# EAGLE schematic BG96 Arduino Uno Shield (EAGLE 9.5.2)
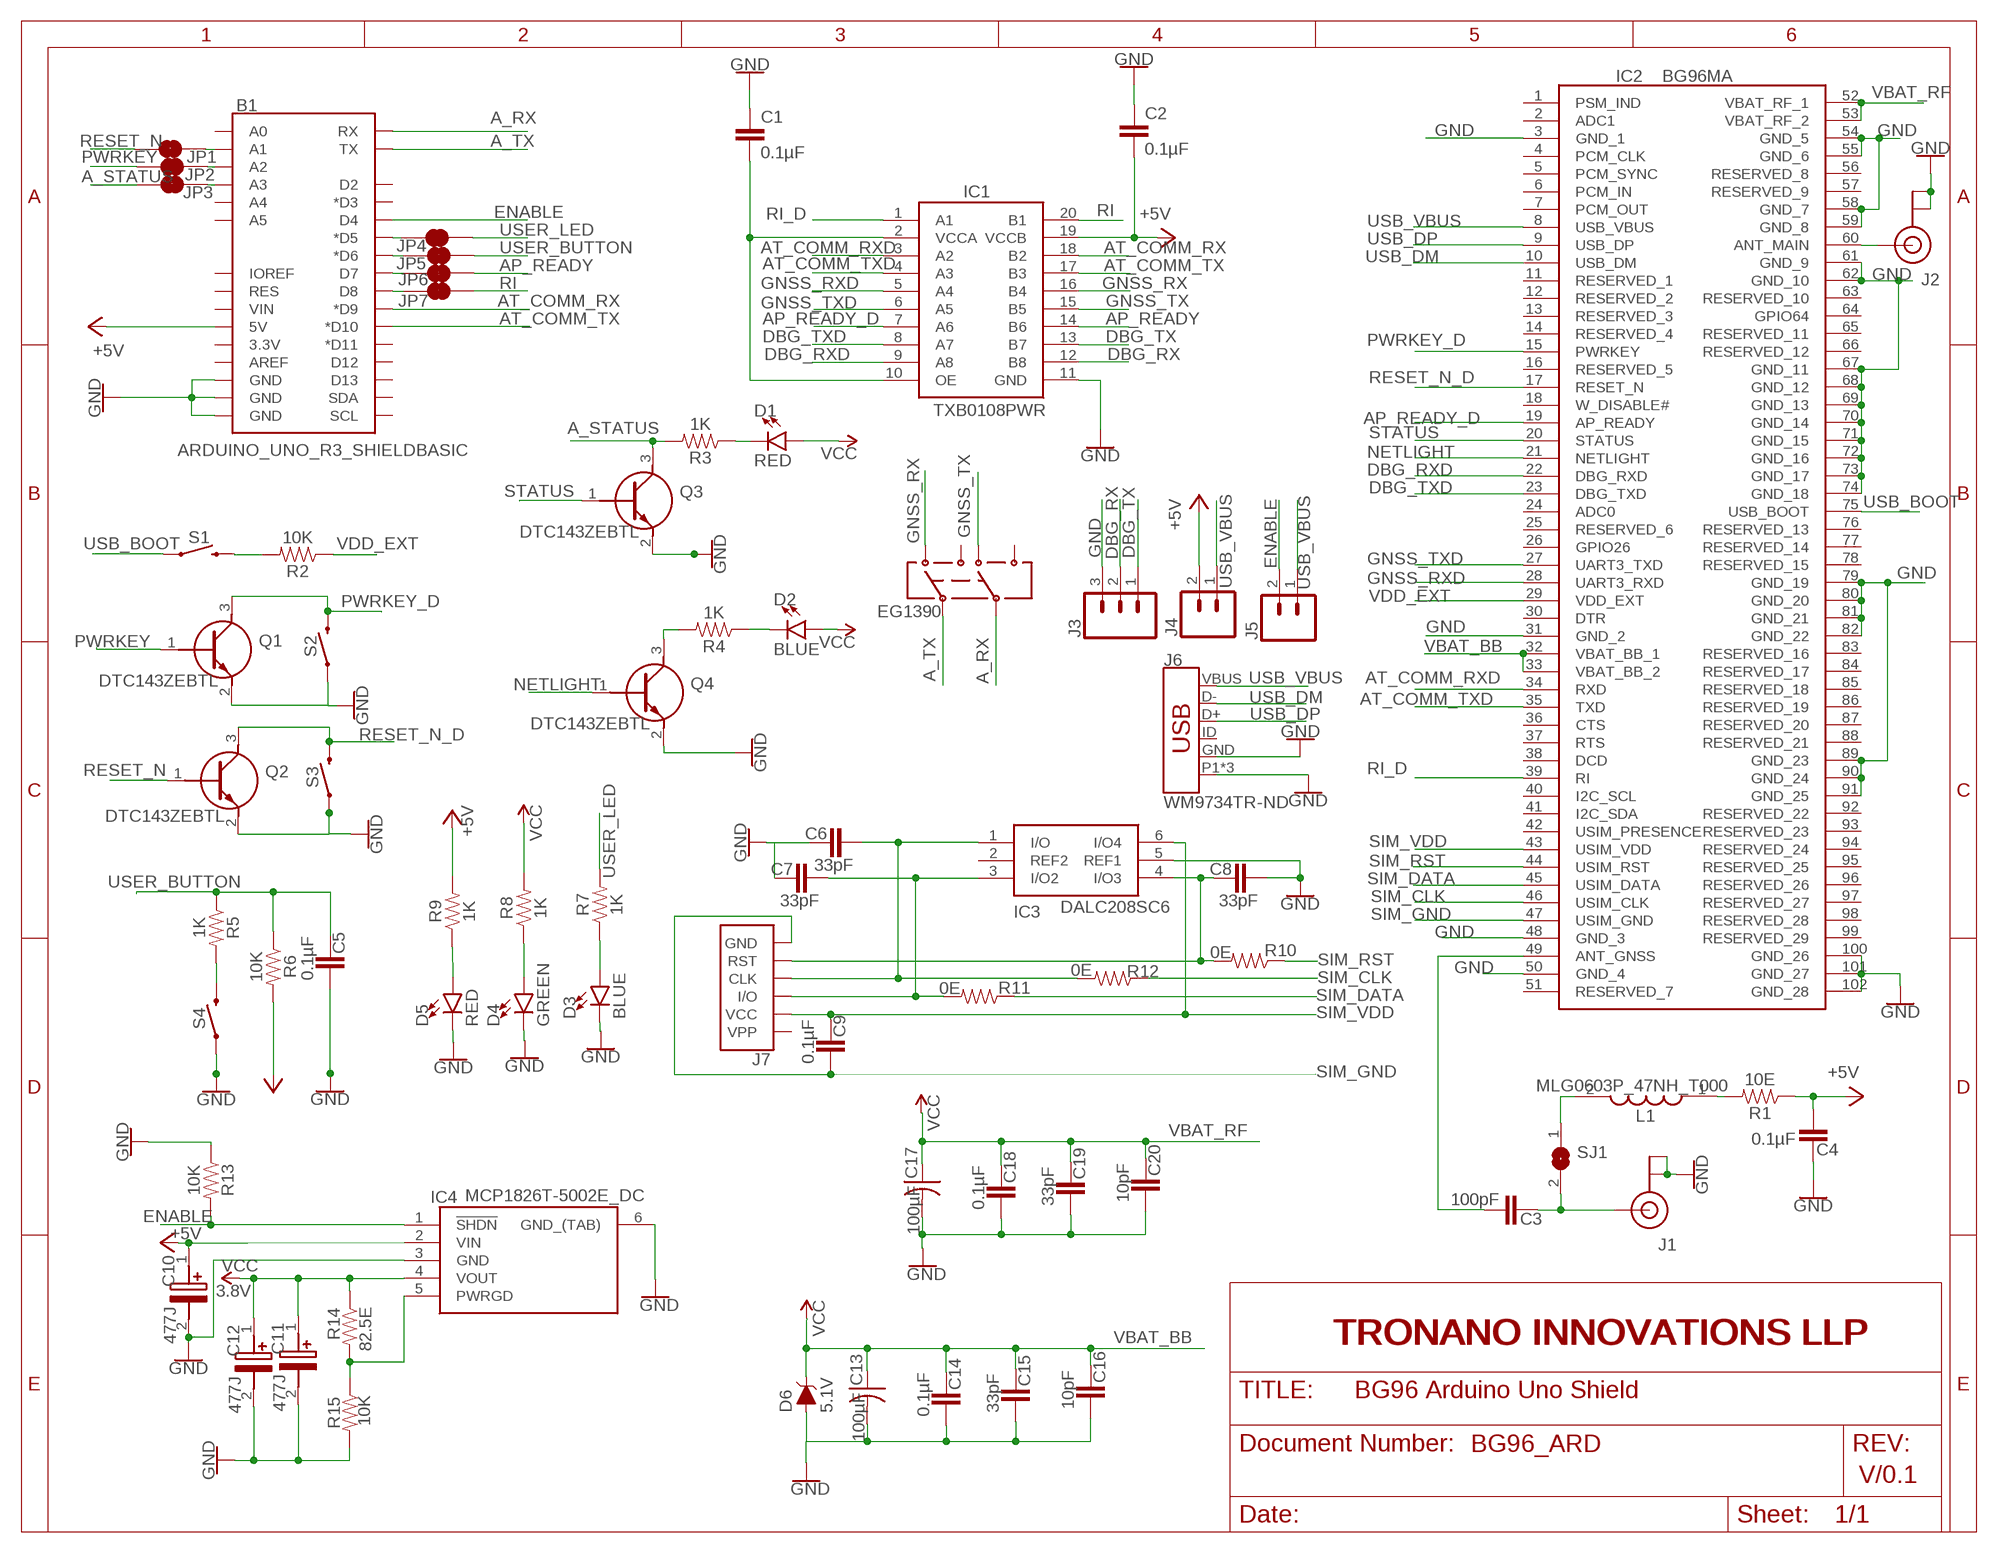
[diagram p0: schematic, sheet 1]

## Parts
B1  ARDUINO_UNO_R3_SHIELDBASIC  [UNO_R3_SHIELD]
C1  0.1µF  0.33UF/330NF-0805-50V-10%  [0805]
C2  0.1µF  0.33UF/330NF-0805-50V-10%  [0805]
C3  100pF  0.33UF/330NF-0805-50V-10%  [0805]
C4  0.1µF  0.33UF/330NF-0805-50V-10%  [0805]
C5  0.1µF  0.33UF/330NF-0805-50V-10%  [0805]
C6  33pF  0.33UF/330NF-0805-50V-10%  [0805]
C7  33pF  0.33UF/330NF-0805-50V-10%  [0805]
C8  33pF  0.33UF/330NF-0805-50V-10%  [0805]
C9  0.1µF  0.33UF/330NF-0805-50V-10%  [0805]
C10  477J  T495D477M006ATE0457280  [CAPPM7343X310N]
C11  477J  T495D477M006ATE0457280  [CAPPM7343X310N]
C12  477J  T495D477M006ATE0457280  [CAPPM7343X310N]
C13  100µF  C-USC0805K  [C0805K]
C14  0.1µF  0.33UF/330NF-0805-50V-10%  [0805]
C15  33pF  0.33UF/330NF-0805-50V-10%  [0805]
C16  10pF  0.33UF/330NF-0805-50V-10%  [0805]
C17  100µF  C-USC0805K  [C0805K]
C18  0.1µF  0.33UF/330NF-0805-50V-10%  [0805]
C19  33pF  0.33UF/330NF-0805-50V-10%  [0805]
C20  10pF  0.33UF/330NF-0805-50V-10%  [0805]
D1  RED  LED-BLUE1206  [LED-1206]
D2  BLUE  LED-BLUE1206  [LED-1206]
D3  BLUE  LED-BLUE1206  [LED-1206]
D4  GREEN  LED-BLUE1206  [LED-1206]
D5  RED  LED-BLUE1206  [LED-1206]
D6  5.1V  DIODE-ZENER-MMSZ5232BS  [SOD-323]
EG1390  SWITCH-DPDT-SMD-AYZ0202  [SWITCH_DPDT_SMD_AYZ0202]
IC1  TXB0108PWR  [SOP65P640X120-20N]
IC2  BG96MA  [BG96MA]
IC3  DALC208SC6  [SOT95P280X145-6N]
IC4  MCP1826T-5002E_DC  [SOT127P706X180-6N]
J1  U.FL  [U.FL]
J2  U.FL  [U.FL]
J3  CONN_03LOCK  [1X03_LOCK]
J4  CONN_02  [1X02]
J5  CONN_02  [1X02]
J6  WM9734TR-ND  USB_MICRO-B_FEMALE-SMT-VERT  [USB-B-MICRO-SMD_VERT]
J7  SIMHOLDERSIM  [SIMHOLDER]
JP1  JUMPER-SMT_2_NC_TRACE_NO-SILK  [SMT-JUMPER_2_NC_TRACE_NO-SILK]
JP2  JUMPER-SMT_2_NC_TRACE_NO-SILK  [SMT-JUMPER_2_NC_TRACE_NO-SILK]
JP3  JUMPER-SMT_2_NC_TRACE_NO-SILK  [SMT-JUMPER_2_NC_TRACE_NO-SILK]
JP4  JUMPER-SMT_2_NC_TRACE_NO-SILK  [SMT-JUMPER_2_NC_TRACE_NO-SILK]
JP5  JUMPER-SMT_2_NC_TRACE_NO-SILK  [SMT-JUMPER_2_NC_TRACE_NO-SILK]
JP6  JUMPER-SMT_2_NC_TRACE_NO-SILK  [SMT-JUMPER_2_NC_TRACE_NO-SILK]
JP7  JUMPER-SMT_2_NC_TRACE_NO-SILK  [SMT-JUMPER_2_NC_TRACE_NO-SILK]
L1  MLG0603P_47NH_T000  MLG0603P47NHT000  [INDC0603X33N]
Q1  DTC143ZEBTL  [SOTFL50P160X85-3N]
Q2  DTC143ZEBTL  [SOTFL50P160X85-3N]
Q3  DTC143ZEBTL  [SOTFL50P160X85-3N]
Q4  DTC143ZEBTL  [SOTFL50P160X85-3N]
R1  10E  0.3OHM-0805-1/8W-1%  [0805]
R2  10K  0.3OHM-0805-1/8W-1%  [0805]
R3  1K  0.3OHM-0805-1/8W-1%  [0805]
R4  1K  0.3OHM-0805-1/8W-1%  [0805]
R5  1K  0.3OHM-0805-1/8W-1%  [0805]
R6  10K  0.3OHM-0805-1/8W-1%  [0805]
R7  1K  0.3OHM-0805-1/8W-1%  [0805]
R8  1K  0.3OHM-0805-1/8W-1%  [0805]
R9  1K  0.3OHM-0805-1/8W-1%  [0805]
R10  0E  0.3OHM-0805-1/8W-1%  [0805]
R11  0E  0.3OHM-0805-1/8W-1%  [0805]
R12  0E  0.3OHM-0805-1/8W-1%  [0805]
R13  10K  0.3OHM-0805-1/8W-1%  [0805]
R14  82.5E  0.3OHM-0805-1/8W-1%  [0805]
R15  10K  0.3OHM-0805-1/8W-1%  [0805]
S1  MOMENTARY-SWITCH-SPST-SMD-6.2MM-TALL  [TACTILE_SWITCH_SMD_6.2MM_TALL]
S2  MOMENTARY-SWITCH-SPST-SMD-6.2MM-TALL  [TACTILE_SWITCH_SMD_6.2MM_TALL]
S3  MOMENTARY-SWITCH-SPST-SMD-6.2MM-TALL  [TACTILE_SWITCH_SMD_6.2MM_TALL]
S4  MOMENTARY-SWITCH-SPST-SMD-6.2MM-TALL  [TACTILE_SWITCH_SMD_6.2MM_TALL]
SJ1  SJ  [SJ]

## Nets
3.8V: C11.1(+) C12.1(+) IC4.4(VOUT) R14.1 ; supply symbol labelled VCC
+5V: B1.5V C2.2 C4.1 C10.1(+) IC1.19(VCCB) IC4.2(VIN) J4.2 R1.1 R6.2 R9.2
A_RX: B1.RX EG1390.5
A_STATUS: JP3.1 Q3.3(C) R3.2
A_TX: B1.TX EG1390.2
AP_READY: IC1.14(B6) JP6.2
AP_READY_D: IC1.7(A6) IC2.19(AP_READY)
AT_COMM_RX: B1.D9(*D9) IC1.18(B2)
AT_COMM_RXD: IC1.3(A2) IC2.34(RXD)
AT_COMM_TX: B1.D10(*D10) IC1.17(B3)
AT_COMM_TXD: IC1.4(A3) IC2.35(TXD)
DBG_RX: IC1.12(B8) J3.2
DBG_RXD: IC1.9(A8) IC2.22(DBG_RXD)
DBG_TX: IC1.13(B7) J3.1
DBG_TXD: IC1.8(A7) IC2.23(DBG_TXD)
ENABLE: B1.D4 IC4.1(!SHDN) J5.2 R13.2
GND: B1.GND@0(GND) B1.GND@1(GND) B1.GND@2(GND) C1.1 C2.1 C4.2 C5.2 C6.1 C7.1 C8.2 C10.2(-) C11.2(-) C12.2(-) C13.2 C14.2 C15.2 C16.2 C17.2 C18.2 C19.2 C20.2 D3.C D4.C D5.C D6.A IC1.11(GND) IC2.3(GND_1) IC2.31(GND_2) IC2.48(GND_3) IC2.50(GND_4) IC2.54(GND_5) IC2.55(GND_6) IC2.58(GND_7) IC2.59(GND_8) IC2.61(GND_9) IC2.62(GND_10) IC2.67(GND_11) IC2.68(GND_12) IC2.69(GND_13) IC2.70(GND_14) IC2.71(GND_15) IC2.72(GND_16) IC2.73(GND_17) IC2.74(GND_18) IC2.79(GND_19) IC2.80(GND_20) IC2.81(GND_21) IC2.82(GND_22) IC2.89(GND_23) IC2.90(GND_24) IC2.91(GND_25) IC2.100(GND_26) IC2.101(GND_27) IC2.102(GND_28) IC3.5(REF1) IC4.3(GND) IC4.6(GND_(TAB)) J1.1(GND) J1.2(GND) J2.1(GND) J2.2(GND) J3.3 J6.GND J6.P1(SHIELD) J6.P2(SHIELD) J6.P3(SHIELD) Q1.2(E) Q2.2(E) Q3.2(E) Q4.2(E) R13.1 R15.2 S2.A2 S3.A2 S4.A2
GNSS_RX: EG1390.1 IC1.16(B4)
GNSS_RXD: IC1.5(A4) IC2.28(UART3_RXD)
GNSS_TX: EG1390.4 IC1.15(B5)
GNSS_TXD: IC1.6(A5) IC2.27(UART3_TXD)
N$1: B1.A1 JP1.2
N$2: B1.A2 JP2.2
N$3: B1.A3 JP3.2
N$4: B1.D5(*D5) JP4.1
N$5: B1.D6(*D6) JP5.1
N$6: B1.D7 JP6.1
N$7: B1.D8 JP7.1
N$8: C1.2 IC1.2(VCCA) IC1.10(OE)
N$9: L1.2 SJ1.1
N$10: IC2.60(ANT_MAIN) J2.FEED(SIGNAL)
N$11: C3.2 IC2.49(ANT_GNSS)
N$12: C3.1 J1.FEED(SIGNAL) SJ1.2
N$13: Q4.3(C) R4.2
N$14: L1.1 R1.2
N$15: R2.2 S1.B2
N$16: R5.2 S4.B2
N$17: D2.C R4.1
N$18: D3.A R7.1
N$19: D4.A R8.1
N$20: D1.C R3.1
N$21: D5.A R9.1
N$22: C6.2 IC3.1(I/O) J7.C3(CLK) R12.2
N$23: IC4.5(PWRGD) R14.2 R15.1
N$24: C7.2 IC3.3(I/O2) J7.C7(I/O) R11.2
N$26: C8.1 IC3.4(I/O3) J7.C2(RST) R10.2
NETLIGHT: IC2.21(NETLIGHT) Q4.1(B)
PWRKEY: JP2.1 Q1.1(B)
PWRKEY_D: IC2.15(PWRKEY) Q1.3(C) S2.B2
RESET_N: JP1.1 Q2.1(B)
RESET_N_D: IC2.17(RESET_N) Q2.3(C) S3.B2
RI: IC1.20(B1) JP7.2
RI_D: IC1.1(A1) IC2.39(RI)
SIM_CLK: IC2.46(USIM_CLK) R12.1
SIM_DATA: IC2.45(USIM_DATA) R11.1
SIM_GND: C9.2 IC2.47(USIM_GND) J7.C5(GND)
SIM_RST: IC2.44(USIM_RST) R10.1
SIM_VDD: C9.1 IC2.43(USIM_VDD) IC3.6(I/O4) J7.C1(VCC)
STATUS: IC2.20(STATUS) Q3.1(B)
USB_BOOT: IC2.75(USB_BOOT) S1.A2
USB_DM: IC2.10(USB_DM) J6.D-
USB_DP: IC2.9(USB_DP) J6.D+
USB_VBUS: IC2.8(USB_VBUS) J4.1 J5.1 J6.VBUS
USER_BUTTON: C5.1 JP5.2 R5.1 R6.1
USER_LED: JP4.2 R7.2
VBAT_BB: C13.1 C14.1 C15.1 C16.1 D6.C IC2.32(VBAT_BB_1) IC2.33(VBAT_BB_2) ; supply symbol labelled VCC
VBAT_RF: C17.1 C18.1 C19.1 C20.1 IC2.52(VBAT_RF_1) IC2.53(VBAT_RF_2) ; supply symbol labelled VCC
VCC: D1.A D2.A R8.2
VDD_EXT: IC2.29(VDD_EXT) R2.1
Unconnected: B1.3.3V B1.A0 B1.A4 B1.A5 B1.AREF B1.D2 B1.D3(*D3) B1.D11(*D11) B1.D12 B1.D13 B1.IOREF B1.RES B1.SCL B1.SDA B1.VIN EG1390.3 EG1390.6 IC2.1(PSM_IND) IC2.2(ADC1) IC2.4(PCM_CLK) IC2.5(PCM_SYNC) IC2.6(PCM_IN) IC2.7(PCM_OUT) IC2.11(RESERVED_1) IC2.12(RESERVED_2) IC2.13(RESERVED_3) IC2.14(RESERVED_4) IC2.16(RESERVED_5) IC2.18(W_DISABLE#) IC2.24(ADC0) IC2.25(RESERVED_6) IC2.26(GPIO26) IC2.30(DTR) IC2.36(CTS) IC2.37(RTS) IC2.38(DCD) IC2.40(I2C_SCL) IC2.41(I2C_SDA) IC2.42(USIM_PRESENCE) IC2.51(RESERVED_7) IC2.56(RESERVED_8) IC2.57(RESERVED_9) IC2.63(RESERVED_10) IC2.64(GPIO64) IC2.65(RESERVED_11) IC2.66(RESERVED_12) IC2.76(RESERVED_13) IC2.77(RESERVED_14) IC2.78(RESERVED_15) IC2.83(RESERVED_16) IC2.84(RESERVED_17) IC2.85(RESERVED_18) IC2.86(RESERVED_19) IC2.87(RESERVED_20) IC2.88(RESERVED_21) IC2.92(RESERVED_22) IC2.93(RESERVED_23) IC2.94(RESERVED_24) IC2.95(RESERVED_25) IC2.96(RESERVED_26) IC2.97(RESERVED_27) IC2.98(RESERVED_28) IC2.99(RESERVED_29) IC3.2(REF2) J6.ID J7.C6(VPP)

## Notes on the sheet
- TRONANO INNOVATIONS LLP | TRONANO INNOVATIONS LLP
- BG96_ARD
- V/0.1

## Library data of the parts
B1 = SparkFun-Boards:ARDUINO_UNO_R3_SHIELD: Arduino R3 Shield Footprint Shield form compatible with the Arduino Uno R3. SparkFun Products: MG2639 Cellular Shield <https://www.sparkfun.com/products/13120> MIDI Shield <https://www.sparkfun.com/products/12898> R3 Stackable Headers Kit <https://www.sparkfun.com/products/11417>
C1-C9 C14-C16 C18-C20 = SparkFun-Capacitors:0.33UF/330NF: 0.33µF/330nF ceramic capacitors A capacitor is a passive two-terminal electrical component used to store electrical energy temporarily in an electric field.; PROD_ID: CAP-08469; VALUE: 0.33µF
C10-C12 = SamacSys_Parts:T495D477M006ATE0457280: Tantalum Capacitors - Solid SMD 6.3V 470uF 20% ESR=45mOhms Source: Datasheet <https://componentsearchengine.com/Datasheets/1/T495D477M006ATE0457280.pdf>; DESCRIPTION: Tantalum Capacitors - Solid SMD 6.3V 470uF 20% ESR=45mOhms; HEIGHT: 3.1mm; MANUFACTURER_NAME: Kemet; MANUFACTURER_PART_NUMBER: T495D477M006ATE0457280; MOUSER_PART_NUMBER: 80-T495D477M06ATE045; MOUSER_PRICE-STOCK: https://www.mouser.com/Search/Refine.aspx?Keyword=80-T495D477M06ATE045
C13 C17 = rcl:C-US: CAPACITOR, American symbol; SPICEPREFIX: C
D1 D4 D5 = SparkFun-LED:LED-BLUE: Blue SMD LED Used in manufacturing of various products at SparkFun Packages: 0603 - SMD 0603 package [Product Link] <http://www.digikey.com/product-detail/en/SMLE12BC7TT86/511-1589-2-ND/1641808> 1206 - SMD1206 package [Product Link] <http://www.digikey.com/product-detail/en/lite-on-inc/LTST-C150TBKT/160-1643-1-ND/573584> SparkFun Products: ESP8266 Thing-Dev Board <https://www.sparkfun.com/products/13711> RedBoard <https://www.sparkfun.com/products/12757>; PROD_ID: DIO-09911; VALUE: BLUE
D2 D3 = SparkFun-LED:LED-BLUE: Blue SMD LED Used in manufacturing of various products at SparkFun Packages: 0603 - SMD 0603 package [Product Link] <http://www.digikey.com/product-detail/en/SMLE12BC7TT86/511-1589-2-ND/1641808> 1206 - SMD1206 package [Product Link] <http://www.digikey.com/product-detail/en/lite-on-inc/LTST-C150TBKT/160-1643-1-ND/573584> SparkFun Products: ESP8266 Thing-Dev Board <https://www.sparkfun.com/products/13711> RedBoard <https://www.sparkfun.com/products/12757>; PROD_ID: DIO-09911
D6 = SparkFun-DiscreteSemi:DIODE-ZENER: Zener Diode A Zener diode allows current to flow from its anode to its cathode like a normal semiconductor diode, but it also permits current to flow in the reverse direction when its "Zener voltage" is reached. - WIkipedia; PROD_ID: DIO-12442; VALUE: 5.6V
EG1390 = SparkFun-Switches:SWITCH-DPDT: Double-Pole, Double-Throw (DPDT) Switch Double-pole, double-throw switches. Variant Overview PTH-GPI-152-3013 Used on SparkFun Geiger Counter <https://www.sparkfun.com/products/11345> SMD-AY0202 Surface Mount DPDT Switch <https://www.sparkfun.com/products/597> (COM-00597) Used on e.g. LilyPad Arduino USB - ATmega32U4 Board <https://www.sparkfun.com/products/12049>; PROD_ID: SWCH-08179; SF_SKU: COM-00597
IC1 = SamacSys_Parts:TXB0108PWR: 8-Bit Bidirectional Voltage-Level Shifter with Auto Direction Sensing and +/-15-kV ESD Protect Source: Datasheet <http://www.ti.com/lit/ds/symlink/txb0108.pdf>; DESCRIPTION: 8-Bit Bidirectional Voltage-Level Shifter with Auto Direction Sensing and +/-15-kV ESD Protect; HEIGHT: 1.2mm; MANUFACTURER_NAME: Texas Instruments; MANUFACTURER_PART_NUMBER: TXB0108PWR; MOUSER_PART_NUMBER: 595-TXB0108PWR; MOUSER_PRICE-STOCK: https://www.mouser.com/Search/Refine.aspx?Keyword=595-TXB0108PWR; RS_PART_NUMBER: 7094614P; RS_PRICE-STOCK: http://uk.rs-online.com/web/p/products/7094614P
IC2 = BG96MA:BG96MA: LTE Module Source: Datasheet <http://www.quectel.com/product/bg96.htm>; DESCRIPTION: LTE Module; HEIGHT: 2mm; MANUFACTURER_NAME: Quectel; MANUFACTURER_PART_NUMBER: BG96MA
IC3 = SamacSys_Parts:DALC208SC6: TVS Diode Array DALC208SC6 Octal, SOT-23 6-Pin Source: Datasheet <https://componentsearchengine.com/Datasheets/1/DALC208SC6.pdf>; DESCRIPTION: TVS Diode Array DALC208SC6 Octal, SOT-23 6-Pin; HEIGHT: 1.45mm; MANUFACTURER_NAME: STMicroelectronics; MANUFACTURER_PART_NUMBER: DALC208SC6; MOUSER_PART_NUMBER: 511-DALC208SC6; MOUSER_PRICE-STOCK: https://www.mouser.com/Search/Refine.aspx?Keyword=511-DALC208SC6
IC4 = SamacSys_Parts:MCP1826T-5002E_DC: LDO Regulator 1A 5.0V PG SOT223-5 MCP1826T-5002E/DC, Low Dropout Voltage Regulator, 1A, 5 V +/-2%, 2.3 6 Vin, 6-Pin SOT-223 Source: Datasheet <https://componentsearchengine.com/Datasheets/1/MCP1826T-5002E_DC.pdf>; DESCRIPTION: LDO Regulator 1A 5.0V PG SOT223-5 MCP1826T-5002E/DC, Low Dropout Voltage Regulator, 1A, 5 V +/-2%, 2.3 6 Vin, 6-Pin SOT-223; HEIGHT: 1.8mm; MANUFACTURER_NAME: Microchip; MANUFACTURER_PART_NUMBER: MCP1826T-5002E/DC; MOUSER_PART_NUMBER: 579-MCP1826T-5002EDC; MOUSER_PRICE-STOCK: https://www.mouser.com/Search/Refine.aspx?Keyword=579-MCP1826T-5002EDC
J1 J2 = SparkFun-Connectors:U.FL: SMD Antenna Connector - U.FL 2mm height, 3.0mm x 3.0mm receptacle size. SparkFun Products: SparkFun WiFi Shield - ESP8266 <https://www.sparkfun.com/products/13287> SparkFun ESP8266 Thing <https://www.sparkfun.com/products/13231> SparkFun MiniGen - Pro Mini Signal Generator Shield <https://www.sparkfun.com/products/11420>; PROD_ID: CONN-09193; SF_ID: WRL-09144
J3 = SparkFun-Connectors:CONN_03: Multi connection point. Often used as Generic Header-pin footprint for 0.1 inch spaced/style header connections On any of the 0.1 inch spaced packages, you can populate with these: Break Away Headers - Straight <https://www.sparkfun.com/products/116> (PRT-00116) Break Away Male Headers - Right Angle <https://www.sparkfun.com/products/553> (PRT-00553) Female Headers <https://www.sparkfun.com/products/115> (PRT-00115) Break Away Headers - Machine Pin <https://www.sparkfun.com/products/117> (PRT-00117) Break Away Female Headers - Swiss Machine Pin <https://www.sparkfun.com/products/743> (PRT-00743) Stackable Header - 3 Pin (Female, 0.1") <https://www.sparkfun.com/products/13875> (PRT-13875) For SCREWTERMINALS and SPRING TERMINALS visit here: Screw Terimnals on SparkFun.com <https://www.sparkfun.com/search/results?term=Screw+Terminals> (5mm/3.5mm/2.54mm spacing) This device is also useful as a general connection point to wire up your design to another part of your project. Our various solder wires solder well into these plated through hole pads. Hook-Up Wire - Assortment (Stranded, 22 AWG) <https://www.sparkfun.com/products/11375> (PRT-11375) Hook-Up Wire - Assortment (Solid Core, 22 AWG) <https://www.sparkfun.com/products/11367> (PRT-11367) View the entire wire category on our website here <https://www.sparkfun.com/categories/141> Special notes: Molex polarized connector foot print use with SKU : PRT-08232 with associated crimp pins and housings.
J4 J5 = SparkFun-Connectors:CONN_02: Multi connection point. Often used as Generic Header-pin footprint for 0.1 inch spaced/style header connections On any of the 0.1 inch spaced packages, you can populate with these: Break Away Headers - Straight <https://www.sparkfun.com/products/116> (PRT-00116) Break Away Male Headers - Right Angle <https://www.sparkfun.com/products/553> (PRT-00553) Female Headers <https://www.sparkfun.com/products/115> (PRT-00115) Break Away Headers - Machine Pin <https://www.sparkfun.com/products/117> (PRT-00117) Break Away Female Headers - Swiss Machine Pin <https://www.sparkfun.com/products/743> (PRT-00743) For SCREWTERMINALS and SPRING TERMINALS visit here: Screw Terimnals on SparkFun.com <https://www.sparkfun.com/search/results?term=Screw+Terminals> (5mm/3.5mm/2.54mm spacing) This device is also useful as a general connection point to wire up your design to another part of your project. Our various solder wires solder well into these plated through hole pads. Hook-Up Wire - Assortment (Stranded, 22 AWG) <https://www.sparkfun.com/products/11375> (PRT-11375) Hook-Up Wire - Assortment (Solid Core, 22 AWG) <https://www.sparkfun.com/products/11367> (PRT-11367) View the entire wire category on our website here <https://www.sparkfun.com/categories/141> Special notes: Molex polarized connector foot print use with: PRT-08233 with associated crimp pins and housings. 2.54_SCREWTERM for use with PRT-10571. 3.5mm Screw Terminal footprints for PRT-08084 5mm Screw Terminal footprints for use with PRT-08432
J6 = SparkFun-Connectors:USB_MICRO-B: USB Type Micro-B Connector Male/female and PTH/SMT variants SparkFun Products: SparkFun microB USB Breakout <https://www.sparkfun.com/products/12035> SparkFun USB microB Plug Breakout <https://www.sparkfun.com/products/10031> SparkFun ESP8266 Thing <https://www.sparkfun.com/products/13231>; PROD_ID: CONN-13534
J7 = SparkFun-Connectors:SIMHOLDER: SIM Cellular Card Socket SMT 6 pin standard connection. SparkFun Products: SIM Socket <https://www.sparkfun.com/products/548> SparkFun Cellular Shield - MG2639 <https://www.sparkfun.com/products/13120> SparkFun SIM Card Socket Breakout <https://www.sparkfun.com/products/573>; PROD_ID: CONN-08536; SF_ID: PRT-00548
JP1-JP7 = SparkFun-Jumpers:JUMPER-SMT_2_NC_TRACE: Normally closed trace jumper This jumper has a trace between two pads so it's normally closed (NC). Use a razor knife to open the connection. For best results follow the IPC guidelines for cutting traces: Cutout at least 0.063 mm (0.005 in). Remove all loose material to clean up the cut area. Seal the cut with an approved epoxy. Reapply solder to reclose the connection.
L1 = SamacSys_Parts:MLG0603P47NHT000: FIXED IND 47NH 110MA 2.9 OHM SMD Source: Datasheet <https://componentsearchengine.com/Datasheets/1/MLG0603P47NHT000.pdf>; DESCRIPTION: FIXED IND 47NH 110MA 2.9 OHM SMD; HEIGHT: 0.33mm; MANUFACTURER_NAME: TDK; MANUFACTURER_PART_NUMBER: MLG0603P47NHT000; MOUSER_PART_NUMBER: 810-MLG0603P47NHT000; MOUSER_PRICE-STOCK: https://www.mouser.com/Search/Refine.aspx?Keyword=810-MLG0603P47NHT000
Q1-Q4 = SamacSys_Parts:DTC143ZEBTL: ROHM, DTC143ZEBTL NPN Digital Transistor, 100 mA 50 V 4.7 k, Ratio Of 10, 3-Pin SC-89 Source: Datasheet <https://componentsearchengine.com/Datasheets/1/DTC143ZEBTL.pdf>; DESCRIPTION: ROHM, DTC143ZEBTL NPN Digital Transistor, 100 mA 50 V 4.7 k, Ratio Of 10, 3-Pin SC-89; HEIGHT: 0.85mm; MANUFACTURER_NAME: ROHM Semiconductor; MANUFACTURER_PART_NUMBER: DTC143ZEBTL; MOUSER_PART_NUMBER: 755-DTC143ZEBTL; MOUSER_PRICE-STOCK: https://www.mouser.com/Search/Refine.aspx?Keyword=755-DTC143ZEBTL
R1-R15 = SparkFun-Resistors:0.3OHM: 0.3Ω resistor A resistor is a passive two-terminal electrical component that implements electrical resistance as a circuit element. Resistors act to reduce current flow, and, at the same time, act to lower voltage levels within circuits. - Wikipedia; PROD_ID: RES-11622; VALUE: 0.3
S1-S4 = SparkFun-Switches:MOMENTARY-SWITCH-SPST: Momentary Switch (Pushbutton) - SPST Normally-open (NO) SPST momentary switches (buttons, pushbuttons). Variants PTH-12MM - 12mm square, through-hole Momentary Pushbutton Switch - 12mm Square <https://www.sparkfun.com/products/9190> (COM-09190) PTH-6.0MM, PTH-6.0MM-KIT - 6.0mm square, through-hole Mini Pushbutton Switch <https://www.sparkfun.com/products/97> (COM-00097) KIT package intended for soldering kit's - only one side of pads' copper is exposed. PTH-RIGHT-ANGLE-KIT - Right-angle, through-hole Right Angle Tactile Button <https://www.sparkfun.com/products/10791> - Used on SparkFun BigTime Watch Kit <https://www.sparkfun.com/products/11734> SMD-12MM - 12mm square, surface-mount Tactile Button - SMD (12mm) <https://www.sparkfun.com/products/12993> (COM-12993) Used on SparkFun PicoBoard <https://www.sparkfun.com/products/11888> SMD-4.5MM - 4.5mm Square Trackball Switch Used on SparkFun Blackberry Trackballer Breakout <https://www.sparkfun.com/products/13169> SMD-4.6MMX2.8MM - 4.60mm x 2.80mm, surface mount Used on SparkFun SAMD21 Mini Breakout <https://www.sparkfun.com/products/13664> SMD-5.2MM, SMD-5.2-REDUNDANT - 5.2mm square, surface-mount Mini Pushbutton Switch - SMD <https://www.sparkfun.com/products/8720> (COM-08720) Used on Arduino Pro Mini <https://www.sparkfun.com/products/11114> REDUNDANT package connects both switch circuits together SMD-6.0X3.5MM - 6.0 x 3.5mm, surface mount Momentary Reset Switch SMD <https://www.sparkfun.com/products/8229> (COM-08229) SMD-6.2MM-TALL - 6.2mm square, surface mount Tactile Button - SMD (6mm) <https://www.sparkfun.com/products/12992> Used on SparkFun Digital Sandbox <https://www.sparkfun.com/products/12651> SMD-RIGHT-ANGLE - Right-angle, surface mount Used on SparkFun Block for Intel® Edison - Arduino <https://www.sparkfun.com/products/13036>; PROD_ID: SWCH-11966; SF_SKU: COM-12992
SJ1 = jumper:SJ: SMD solder JUMPER